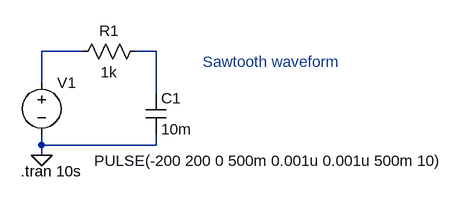
[diagram p0: schematic RC-sawtooth-response simulation.asc]
RC-sawtooth-response simulation.asc, the LTspice schematic file:
Version 4
SHEET 1 880 680
WIRE 128 96 64 96
WIRE 240 96 208 96
WIRE 64 144 64 96
WIRE 240 160 240 96
WIRE 64 240 64 224
WIRE 240 240 240 224
WIRE 240 240 64 240
WIRE 64 256 64 240
FLAG 64 256 0
SYMBOL res 224 80 R90
WINDOW 0 0 56 VBottom 2
WINDOW 3 32 56 VTop 2
SYMATTR InstName R1
SYMATTR Value 1k
SYMBOL cap 224 160 R0
SYMATTR InstName C1
SYMATTR Value 10m
SYMBOL voltage 64 128 R0
WINDOW 123 0 0 Left 2
WINDOW 39 0 0 Left 2
WINDOW 3 81 136 Left 2
SYMATTR Value PULSE(-200 200 0 500m 0.001u 0.001u 500m 10)
SYMATTR InstName V1
TEXT 32 280 Left 2 !.tran 10s
TEXT 312 112 Left 2 ;Sawtooth waveform

The netlist it stands for:
* RC-sawtooth-response simulation.asc
R1 N002 N001 1k
C1 N002 0 10m
V1 N001 0 PULSE(-200 200 0 500m 0.001u 0.001u 500m 10)
.tran 10s
* Sawtooth waveform
.backanno
.end